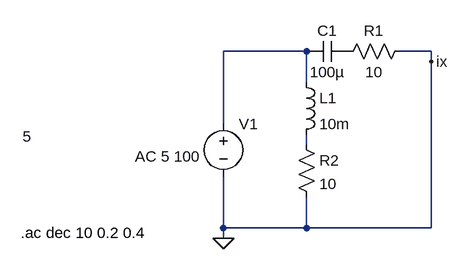
[diagram p0: schematic Task4-vs1.asc]
Task4-vs1.asc, the LTspice schematic file:
Version 4
SHEET 1 880 680
WIRE 224 48 96 48
WIRE 416 48 368 48
WIRE 416 64 416 48
WIRE 224 96 224 48
WIRE 96 160 96 48
WIRE 224 192 224 176
WIRE 96 320 96 240
WIRE 224 320 224 272
WIRE 224 320 96 320
WIRE 416 320 416 64
WIRE 416 320 224 320
WIRE 96 336 96 320
FLAG 416 64 ix
FLAG 96 336 0
SYMBOL voltage 96 144 R0
WINDOW 3 -309 35 Left 2
WINDOW 123 -136 66 Left 2
WINDOW 39 0 0 Left 0
SYMATTR Value 5
SYMATTR Value2 AC 5 100
SYMATTR InstName V1
SYMBOL res 384 32 R90
WINDOW 0 0 56 VBottom 2
WINDOW 3 32 56 VTop 2
SYMATTR InstName R1
SYMATTR Value 10
SYMBOL res 208 176 R0
SYMATTR InstName R2
SYMATTR Value 10
SYMBOL cap 288 32 R90
WINDOW 0 0 32 VBottom 2
WINDOW 3 32 32 VTop 2
SYMATTR InstName C1
SYMATTR Value 100µ
SYMBOL ind 208 80 R0
SYMATTR InstName L1
SYMATTR Value 10m
TEXT -216 328 Left 2 !.ac dec 10 0.2 0.4

The netlist it stands for:
* Task4-vs1.asc
V1 N001 0 5 AC 5 100
R1 0 P001 10
R2 N002 0 10
C1 P001 N001 100µ
L1 N001 N002 10m
.ac dec 10 0.2 0.4
.backanno
.end

* Results of the author's LTspice run, read from the files saved beside the schematic
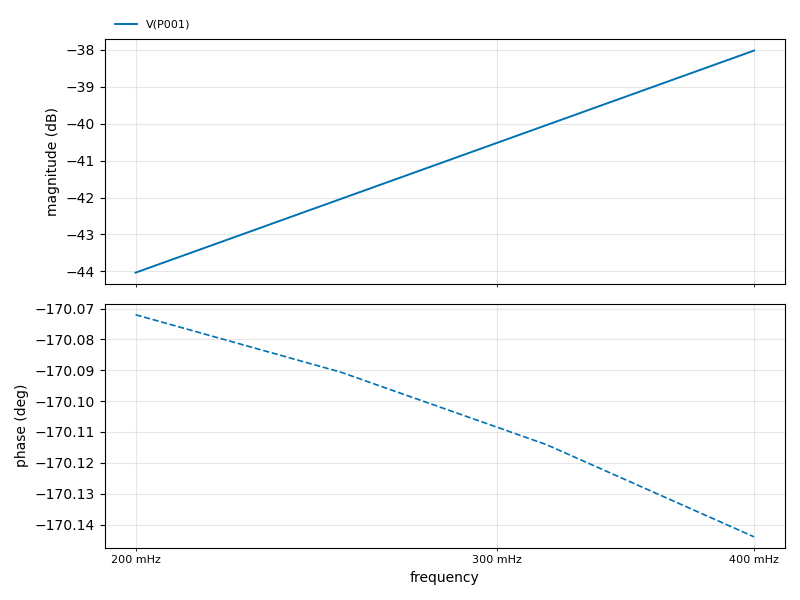
[diagram p1: AC Analysis of Task4-vs1.asc, plotted from the saved traces]
* AC Analysis, 1 run:
*   V(P001): -44.04 dB at 200 mHz, -38.02 dB at 400 mHz, peak -38.02 dB at 400 mHz, 3 dB below the peak at 282.8 mHz